# EAGLE schematic RedBoardCPU6809 (EAGLE 6.3)
Main Board 68B09P CPU 8MHz. Author: FAVARD Laurent 2003/2012
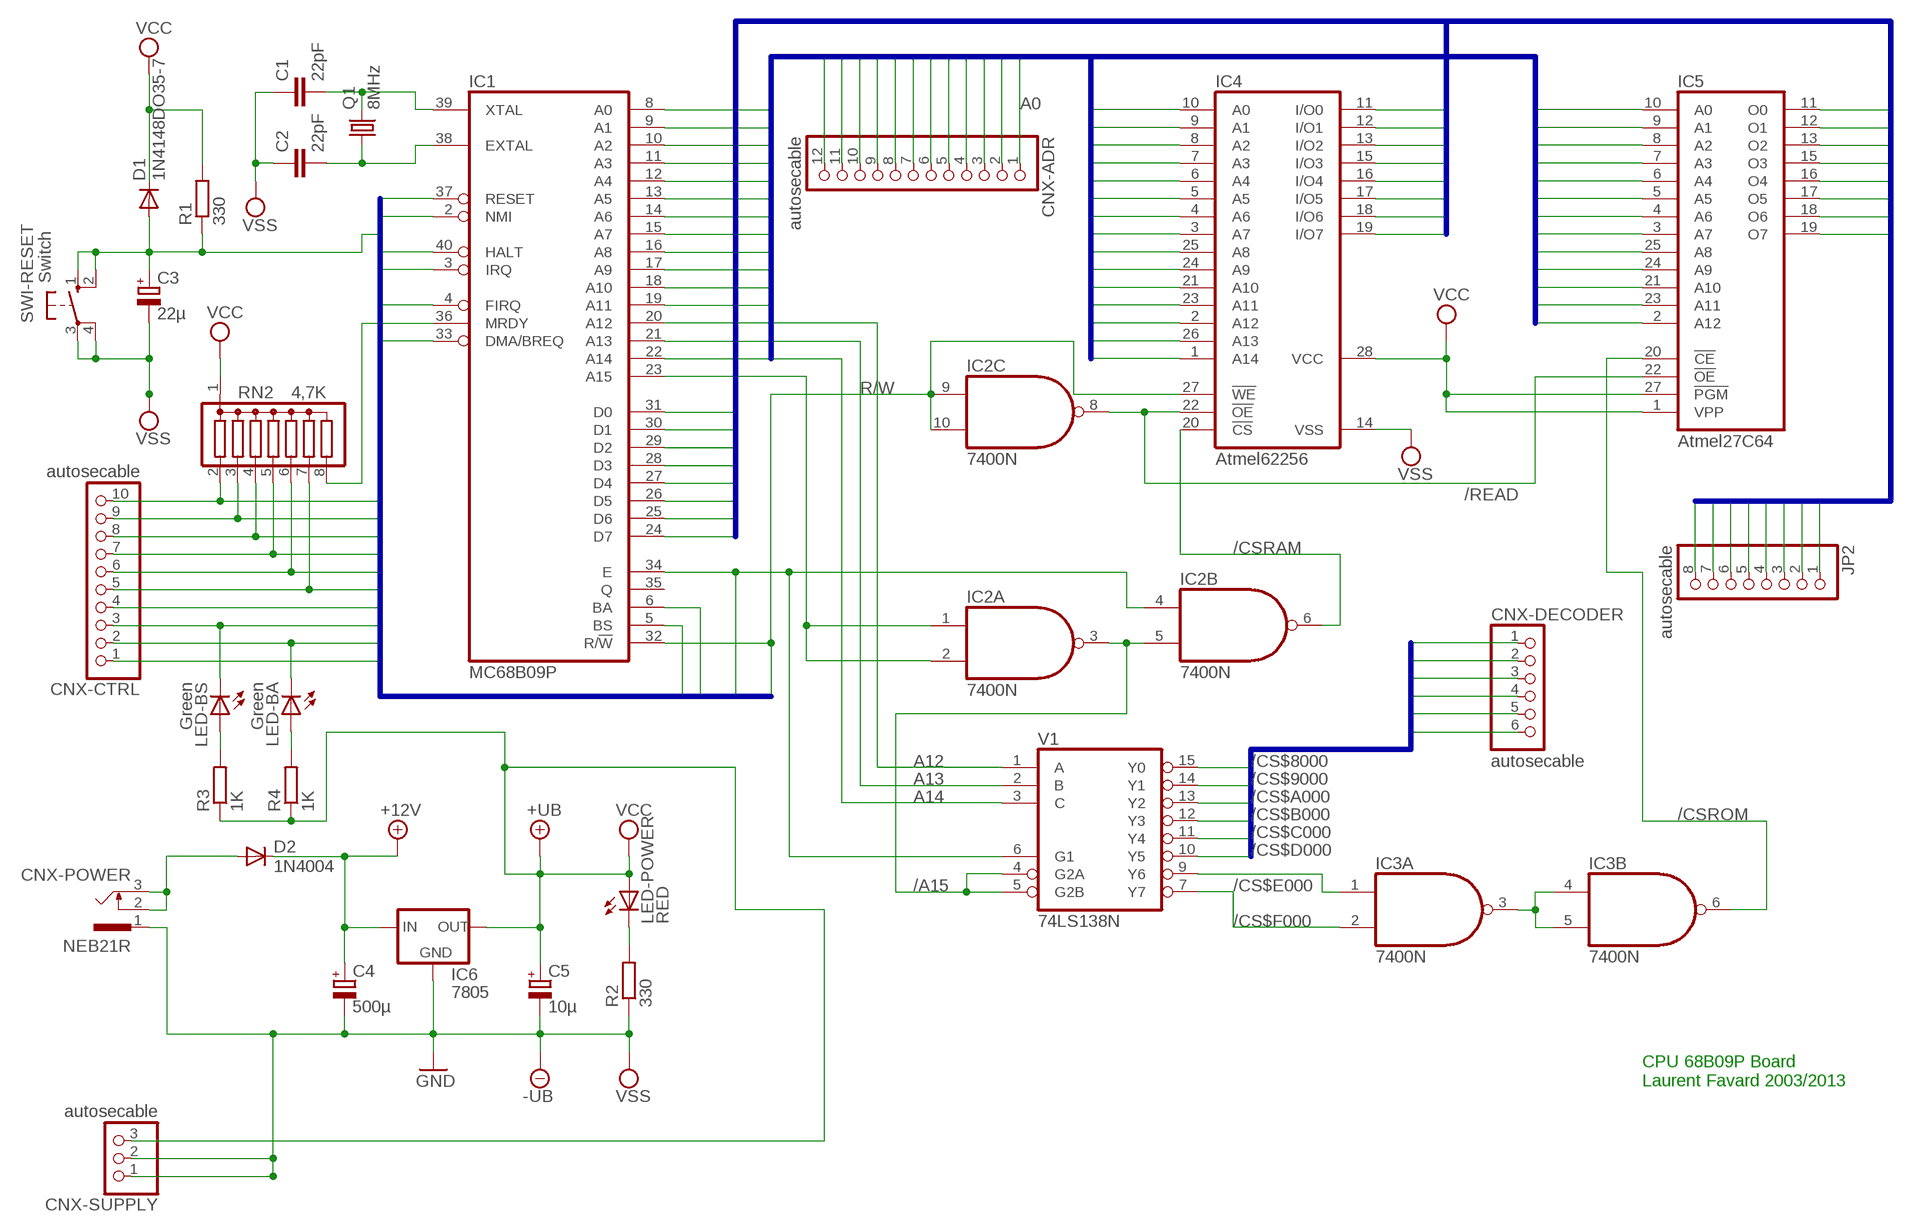
[diagram p0: schematic, sheet 1]

## Parts
C1  22pF  C2,5-3  [C2.5-3]
C2  22pF  C2,5-3  [C2.5-3]
C3  22µ  CPOL-EUE2-5  [E2-5]
C4  500µ  CPOL-EUE2-5  [E2-5]
C5  10µ  CPOL-EUE2-5  [E2-5]
CNX-ADR  autosecable  PINHD-1X12  [1X12]
CNX-CTRL  autosecable  PINHD-1X10  [1X10]
CNX-DECODER  autosecable  PINHD-1X6  [1X06]
CNX-POWER  NEB21R  [NEB21R]
CNX-SUPPLY  autosecable  PINHD-1X3  [1X03]
D1  1N4148DO35-7  [DO35-7]
D2  1N4004  [DO41-10]
IC1  MC68B09P  6809  [DIL40]
IC2  7400N  [DIL14]
IC3  7400N  [DIL14]
IC4  Atmel62256  62256P  [DIL28-6]
IC5  Atmel27C64  2764  [DIL28]
IC6  7805  78XXL  [78XXL]
JP2  autosecable  PINHD-1X8  [1X08]
LED-BA  Green  LED3MM  [LED3MM]
LED-BS  Green  LED3MM  [LED3MM]
LED-POWER  RED  LED3MM  [LED3MM]
Q1  8MHz  CRYSTALHC18U-H  [HC18U-H]
R1  330  R-EU_0207/12  [0207/12]
R2  330  R-EU_0207/12  [0207/12]
R3  1K  R-EU_0207/12  [0207/12]
R4  1K  R-EU_0207/12  [0207/12]
RN2  4,7K  G07R  [SIL8]
SWI-RESET  Switch  10-XX  [B3F-10XX]
V1  74LS138N  [DIL16]

## Nets
+12V: C4.+ D2.C IC6.IN
/A15: IC2.3(A:O) IC2.5(B:I1) V1.4(G2A) V1.5(G2B)
/CS$8000: CNX-DECODER.1 V1.15(Y0)
/CS$9000: CNX-DECODER.2 V1.14(Y1)
/CS$A000: CNX-DECODER.3 V1.13(Y2)
/CS$B000: CNX-DECODER.4 V1.12(Y3)
/CS$C000: CNX-DECODER.5 V1.11(Y4)
/CS$D000: CNX-DECODER.6 V1.10(Y5)
/CS$E000: IC3.1(A:I0) V1.9(Y6)
/CS$F000: IC3.2(A:I1) V1.7(Y7)
/CSRAM: IC2.6(B:O) IC4.20(!CS)
/CSROM: IC3.6(B:O) IC5.20(!CE)
/READ: IC2.8(C:O) IC4.22(!OE) IC5.22(!OE)
A0: CNX-ADR.1 IC1.8(A0) IC4.10(A0) IC5.10(A0)
A1: CNX-ADR.2 IC1.9(A1) IC4.9(A1) IC5.9(A1)
A2: CNX-ADR.3 IC1.10(A2) IC4.8(A2) IC5.8(A2)
A3: CNX-ADR.4 IC1.11(A3) IC4.7(A3) IC5.7(A3)
A4: CNX-ADR.5 IC1.12(A4) IC4.6(A4) IC5.6(A4)
A5: CNX-ADR.6 IC1.13(A5) IC4.5(A5) IC5.5(A5)
A6: CNX-ADR.7 IC1.14(A6) IC4.4(A6) IC5.4(A6)
A7: CNX-ADR.8 IC1.15(A7) IC4.3(A7) IC5.3(A7)
A8: CNX-ADR.9 IC1.16(A8) IC4.25(A8) IC5.25(A8)
A9: CNX-ADR.10 IC1.17(A9) IC4.24(A9) IC5.24(A9)
A10: CNX-ADR.11 IC1.18(A10) IC4.21(A10) IC5.21(A10)
A11: CNX-ADR.12 IC1.19(A11) IC4.23(A11) IC5.23(A11)
A12: IC1.20(A12) IC4.2(A12) IC5.2(A12) V1.1(A)
A13: IC1.21(A13) IC4.26(A13) V1.2(B)
A14: IC1.22(A14) IC4.1(A14) V1.3(C)
BA: CNX-CTRL.2 IC1.6(BA) LED-BA.K(C)
BS: CNX-CTRL.3 IC1.5(BS) LED-BS.K(C)
D0: IC1.31(D0) IC4.11(I/O0) IC5.11(O0) JP2.1
D1: IC1.30(D1) IC4.12(I/O1) IC5.12(O1) JP2.2
D2: IC1.29(D2) IC4.13(I/O2) IC5.13(O2) JP2.3
D3: IC1.28(D3) IC4.15(I/O3) JP2.4
D4: IC1.27(D4) IC4.16(I/O4) IC5.15(O3) IC5.16(O4) JP2.5
D5: IC1.26(D5) IC5.17(O5) JP2.6
D6: IC1.25(D6) IC4.18(I/O6) IC5.18(O6) JP2.7
D7: IC1.24(D7) IC4.17(I/O5) IC4.19(I/O7) IC5.19(O7) JP2.8
DMA/BREQ: CNX-CTRL.5 IC1.33(DMA/BREQ) RN2.7
E: CNX-CTRL.1 IC1.34(E) IC2.4(B:I0) V1.6(G1)
FIRQ: CNX-CTRL.6 IC1.4(FIRQ) RN2.6
HALT: CNX-CTRL.8 IC1.40(HALT) RN2.4
IRQ: CNX-CTRL.7 IC1.3(IRQ) RN2.5
N$1: C1.2 IC1.39(XTAL) Q1.2
N$2: LED-BS.A R3.2
N$3: IC1.23(A15) IC2.1(A:I0) IC2.2(A:I1)
N$4: CNX-POWER.2 CNX-POWER.3 D2.A
N$5: C2.2 IC1.38(EXTAL) Q1.1
N$6: LED-BA.A R4.2
N$7: LED-POWER.K(C) R2.2
N$8: IC3.3(A:O) IC3.4(B:I0) IC3.5(B:I1)
N$17: IC1.36(MRDY) RN2.8
NMI: CNX-CTRL.9 IC1.2(NMI) RN2.3
R/W: CNX-CTRL.4 IC1.32(R/!W) IC2.9(C:I0) IC2.10(C:I1) IC4.27(!WE)
RESET: C3.+ CNX-CTRL.10 D1.A IC1.37(RESET) R1.1 RN2.2 SWI-RESET.1(S) SWI-RESET.2(S1)
VCC: C5.+ CNX-SUPPLY.3 D1.C IC4.28(VCC) IC5.1(VPP) IC5.27(!PGM) IC6.OUT LED-POWER.A R1.2 R3.1 R4.1 RN2.1 ; supply symbol labelled +UB
VSS: C1.1 C2.1 C3.- C4.- C5.- CNX-POWER.1 CNX-SUPPLY.1 CNX-SUPPLY.2 IC4.14(VSS) IC6.GND R2.1 SWI-RESET.3(P) SWI-RESET.4(P1) ; supply symbol labelled GND, -UB
Unconnected: IC1.35(Q) IC2.11(D:O) IC2.12(D:I0) IC2.13(D:I1) IC3.8(C:O) IC3.9(C:I0) IC3.10(C:I1) IC3.11(D:O) IC3.12(D:I0) IC3.13(D:I1)

## Buses
D[0..7]
A[0..14]
/CS$8000,/CS$9000,/CS$A000,/CS$B000,/CS$C000,/CS$D000
RESET,NMI,HALT,IRQ,FIRQ,DMA/BREQ,E,BA,BS,R/W

## Notes on the sheet
- CPU 68B09P Board
  Laurent Favard 2003/2013

## Power pins joined to a net without a drawn wire
GND: IC2.7(P:GND) IC3.7(P:GND) IC5.14(GND) V1.8(GND)
VCC: IC1.7(VCC) IC2.14(P:VCC) IC3.14(P:VCC) IC5.28(VCC) V1.16(VCC)
VSS: IC1.1(VSS)

## Library data of the parts
C1 C2 = capacitor-wima:C: CAPACITOR naming: grid - package width
C3-C5 = rcl:CPOL-EU: POLARIZED CAPACITOR, European symbol
CNX-ADR = pinhead:PINHD-1X12: PIN HEADER
CNX-CTRL = pinhead:PINHD-1X10: PIN HEADER
CNX-DECODER = pinhead:PINHD-1X6: PIN HEADER
CNX-POWER = con-lumberg:NEB21R: Netzgeräte-Einbaukupplung abgewinkelte Ausführung mit Öffner Source: http://www.lumberg.com/Produkte/PDFs/NEB21R.pdf; MPN: NEB 21 R; OC_FARNELL: 1217037; OC_NEWARK: 97K6458
CNX-SUPPLY = pinhead:PINHD-1X3: PIN HEADER
D1 = diode:1N4148: DIODE high speed (Philips)
D2 = diode:1N4004: DIODE general purpose rectifier, 1 A
IC1 = micro-motorola:6809: MICROCONTROLLER/MEMORY DEVICE; MF: NTE ELECTRONICS; MPN: NTE6809; OC_FARNELL: 4530354; OC_NEWARK: 31C2459
IC2 IC3 = 74xx-us:74*00: Quad 2-input NAND gate
IC4 = memory-hitachi:62256P: MEMORY; OC_FARNELL: unknown; OC_NEWARK: unknown
IC5 = memory:2764: MEMORY
IC6 = v-reg:78XXL: VOLTAGE REGULATOR
JP2 = pinhead:PINHD-1X8: PIN HEADER
LED-BA LED-BS LED-POWER = led:LED: LED OSRAM: - CHIPLED LG R971, LG N971, LY N971, LG Q971, LY Q971, LO R971, LY R971 LH N974, LH R974 LS Q976, LO Q976, LY Q976 LO Q996 - Hyper CHIPLED LW Q18S LB Q993, LB Q99A, LB R99A - SideLED LS A670, LO A670, LY A670, LG A670, LP A670 LB A673, LV A673, LT A673, LW A673 LH A674 LY A675 LS A676, LA A676, LO A676, LY A676, LW A676 LS A679, LY A679, LG A679 - Hyper Micro SIDELED® LS Y876, LA Y876, LO Y876, LY Y876 LT Y87S - SmartLED LW L88C, LW L88S LB L89C, LB L89S, LG L890 LS L89K, LO L89K, LY L89K LS L896, LA L896, LO L896, LY L896 - TOPLED LS T670, LO T670, LY T670, LG T670, LP T670 LSG T670, LSP T670, LSY T670, LOP T670, LYG T670 LG T671, LOG T671, LSG T671 LB T673, LV T673, LT T673, LW T673 LH T674 LS T676, LA T676, LO T676, LY T676, LB T676, LH T676, LSB T676, LW T676 LB T67C, LV T67C, LT T67C, LS T67K, LO T67K, LY T67K, LW E67C LS E67B, LA E67B, LO E67B, LY E67B, LB E67C, LV E67C, LT E67C LW T67C LS T679, LY T679, LG T679 LS T770, LO T770, LY T770, LG T770, LP T770 LB T773, LV T773, LT T773, LW T773 LH T774 LS E675, LA E675, LY E675, LS T675 LS T776, LA T776, LO T776, LY T776, LB T776 LHGB T686 LT T68C, LB T68C - Hyper Mini TOPLED® LB M676 - Mini TOPLED Santana® LG M470 LS M47K, LO M47K, LY M47K Source: http://www.osram.convergy.de LUXEON: - LUMILED® LXK2-PW12-R00, LXK2-PW12-S00, LXK2-PW14-U00, LXK2-PW14-V00 LXK2-PM12-R00, LXK2-PM12-S00, LXK2-PM14-U00 LXK2-PE12-Q00, LXK2-PE12-R00, LXK2-PE12-S00, LXK2-PE14-T00, LXK2-PE14-U00 LXK2-PB12-K00, LXK2-PB12-L00, LXK2-PB12-M00, LXK2-PB14-N00, LXK2-PB14-P00, LXK2-PB14-Q00 LXK2-PR12-L00, LXK2-PR12-M00, LXK2-PR14-Q00, LXK2-PR14-R00 LXK2-PD12-Q00, LXK2-PD12-R00, LXK2-PD12-S00 LXK2-PH12-R00, LXK2-PH12-S00 LXK2-PL12-P00, LXK2-PL12-Q00, LXK2-PL12-R00 Source: www.luxeon.com KINGBRIGHT: KA-3528ASYC Source: www.kingbright.com
Q1 = crystal:CRYSTAL: CRYSTAL; OC_FARNELL: unknown; OC_NEWARK: unknown
R1-R4 = rcl:R-EU_: RESISTOR, European symbol
RN2 = resistor-sil:G07R: SIL RESISTOR; OC_FARNELL: unknown; OC_NEWARK: unknown
SWI-RESET = switch-omron:10-XX: OMRON SWITCH; MPN: B3F-1000; OC_FARNELL: 176432; OC_NEWARK: 36M3542
V1 = 74xx-us:74*138: 3-line to 8-line DECODER/DEMULTIPLEXER